# EAGLE design vfd (EAGLE 9.6.2)

## Sheet 1 of 2
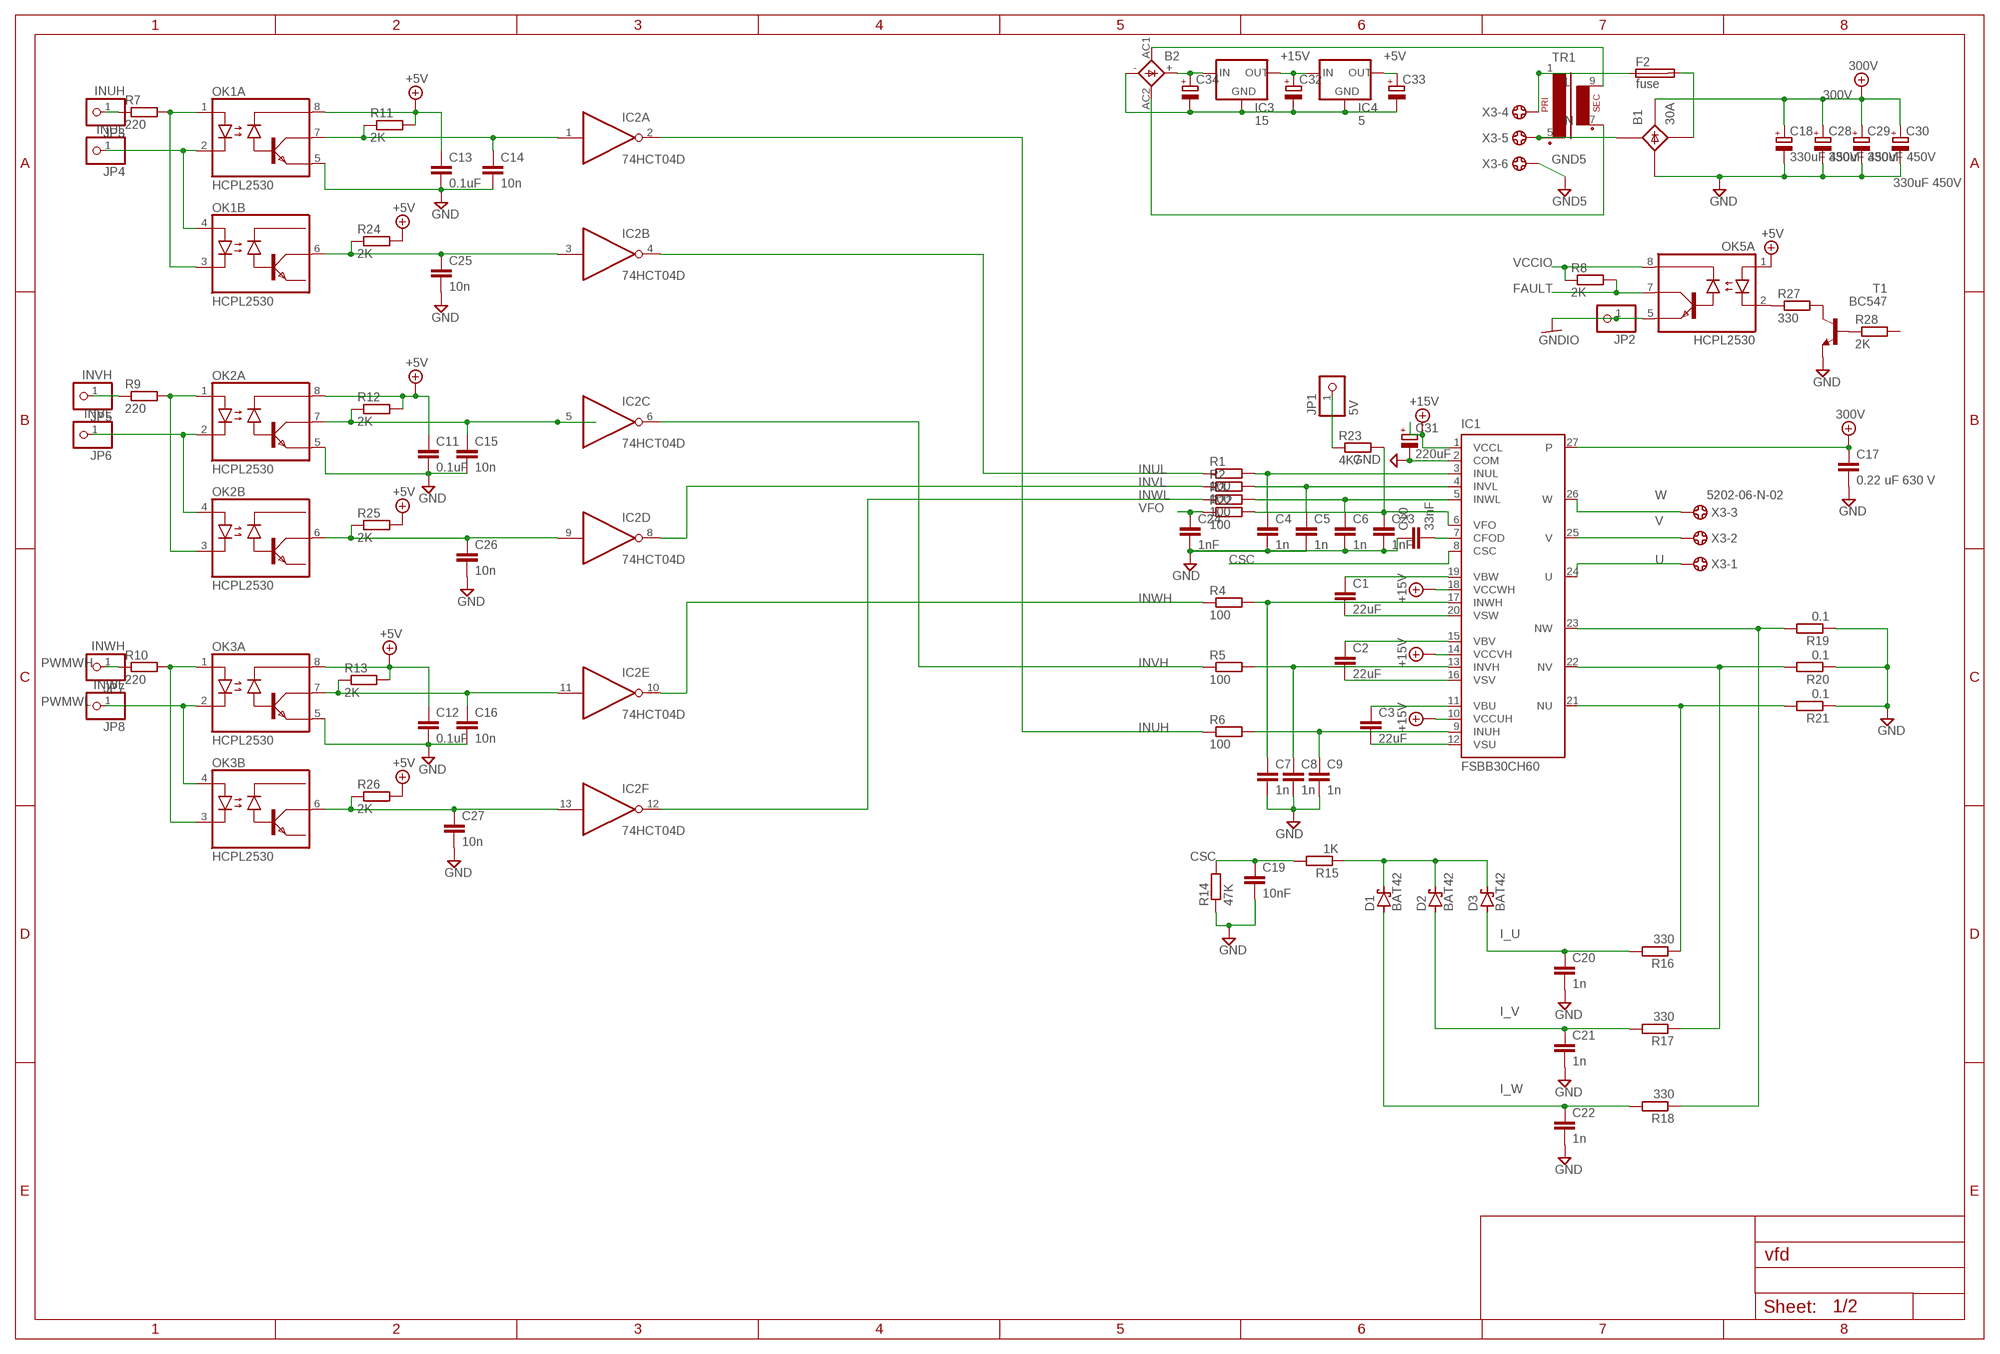
[diagram p0: schematic, sheet 1]

### Parts
B1  30A  B25A-  [B25A-]
B2  S41  [S41]
C1  22uF  C-EU025-024X044  [C025-024X044]
C2  22uF  C-EU025-024X044  [C025-024X044]
C3  22uF  C-EU025-024X044  [C025-024X044]
C4  1n  C-EU025-024X044  [C025-024X044]
C5  1n  C-EU025-024X044  [C025-024X044]
C6  1n  C-EU025-024X044  [C025-024X044]
C7  1n  C-EU025-024X044  [C025-024X044]
C8  1n  C-EU025-024X044  [C025-024X044]
C9  1n  C-EU025-024X044  [C025-024X044]
C10  33nF  C-EU025-024X044  [C025-024X044]
C11  0.1uF  C-EU050-025X075  [C050-025X075]
C12  0.1uF  C-EU050-025X075  [C050-025X075]
C13  0.1uF  C-EU050-025X075  [C050-025X075]
C14  10n  C-EU025-024X044  [C025-024X044]
C15  10n  C-EU025-024X044  [C025-024X044]
C16  10n  C-EU025-024X044  [C025-024X044]
C17  0.22 uF 630 V  C-EU150-091X182  [C150-091X182]
C18  330uF 450V  CPOL-EUE10-35  [EB35D]
C19  10nF  C-EU025-024X044  [C025-024X044]
C20  1n  C-EU025-024X044  [C025-024X044]
C21  1n  C-EU025-024X044  [C025-024X044]
C22  1n  C-EU025-024X044  [C025-024X044]
C23  1nF  C-EU025-024X044  [C025-024X044]
C24  1nF  C-EU025-024X044  [C025-024X044]
C25  10n  C-EU025-024X044  [C025-024X044]
C26  10n  C-EU025-024X044  [C025-024X044]
C27  10n  C-EU025-024X044  [C025-024X044]
C28  330uF 450V  CPOL-EUE10-35  [EB35D]
C29  330uF 450V  CPOL-EUE10-35  [EB35D]
C30  330uF 450V  CPOL-EUE10-35  [EB35D]
C31  220uF  CPOL-EUB45181B  [B45181B]
C32  CPOL-EUB45181A  [B45181A]
C33  CPOL-EUB45181A  [B45181A]
C34  CPOL-EUB45181A  [B45181A]
D1  BAT42  [DO35-10]
D2  BAT42  [DO35-10]
D3  BAT42  [DO35-10]
F2  fuse  SH22  [SH22]
IC1  FSBB30CH60  [FSBB30CH60]
IC2  74HCT04D  [SO14]
IC3  15  78MXXL  [78MXXL]
IC4  5  78MXXL  [78MXXL]
JP1  5V  PINHD-1X1  [1X01]
JP2  PINHD-1X1  [1X01]
JP3  INUH  PINHD-1X1  [1X01]
JP4  INUL  PINHD-1X1  [1X01]
JP5  INVH  PINHD-1X1  [1X01]
JP6  INVL  PINHD-1X1  [1X01]
JP7  INWH  PINHD-1X1  [1X01]
JP8  INWL  PINHD-1X1  [1X01]
OK1  HCPL2530  [DIL08]
OK2  HCPL2530  [DIL08]
OK3  HCPL2530  [DIL08]
OK5  HCPL2530  [DIL08]
R1  100  R-EU_0204/7  [0204/7]
R2  100  R-EU_0204/7  [0204/7]
R3  100  R-EU_0204/7  [0204/7]
R4  100  R-EU_0204/7  [0204/7]
R5  100  R-EU_0204/7  [0204/7]
R6  100  R-EU_0204/7  [0204/7]
R7  220  R-EU_0204/7  [0204/7]
R8  2K  R-EU_0204/7  [0204/7]
R9  220  R-EU_0204/7  [0204/7]
R10  220  R-EU_0204/7  [0204/7]
R11  2K  R-EU_0204/7  [0204/7]
R12  2K  R-EU_0204/7  [0204/7]
R13  2K  R-EU_0204/7  [0204/7]
R14  47K  R-EU_0204/7  [0204/7]
R15  1K  R-EU_0204/7  [0204/7]
R16  330  R-EU_0204/7  [0204/7]
R17  330  R-EU_0204/7  [0204/7]
R18  330  R-EU_0204/7  [0204/7]
R19  0.1  R-EU_0204/7  [0204/7]
R20  0.1  R-EU_0204/7  [0204/7]
R21  0.1  R-EU_0204/7  [0204/7]
R22  100  R-EU_0204/7  [0204/7]
R23  4K7  R-EU_0204/7  [0204/7]
R24  2K  R-EU_0204/7  [0204/7]
R25  2K  R-EU_0204/7  [0204/7]
R26  2K  R-EU_0204/7  [0204/7]
R27  330  R-EU_0204/7  [0204/7]
R28  2K  R-EU_0204/7  [0204/7]
T1  BC547  [TO92]
TR1  EI30-1  [EI30-1]
X3  5202-06-N-02  [5202-06-N-02]

### Nets
3: C4.1 IC1.3(INUL) R1.2
4: C5.1 IC1.4(INVL) R2.2
5: C6.1 IC1.5(INWL) R3.2
6: C23.1 IC1.6(VFO) R22.2 R23.2
7: C10.2 IC1.7(CFOD)
9: C9.1 IC1.9(INUH) R6.2
11: C3.1 IC1.11(VBU)
13: C8.1 IC1.13(INVH) R5.2
15: C2.1 IC1.15(VBV)
16: C2.2 IC1.16(VSV)
17: C7.1 IC1.17(INWH) R4.2
19: C1.1 IC1.19(VBW)
20: C1.2 IC1.20(VSW)
300V: B1.+1(+) C17.1 C18.+ C28.+ C29.+ C30.+ IC1.27(P)
+5V: C11.1 C12.1 C13.1 C33.+ IC4.OUT OK1.8(A:VCC) OK2.8(A:VCC) OK3.8(A:VCC) OK5.1(A:A1) R11.2 R12.2 R13.2 R24.2 R25.2 R26.2
+15V: C31.+ C32.+ IC1.1(VCCL) IC1.10(VCCUH) IC1.14(VCCVH) IC1.18(VCCWH) IC3.OUT IC4.IN
CSC: C19.1 IC1.8(CSC) R14.2 R15.2
FAULT: OK5.7(A:VO1) R8.2
GND: B1.-1(-) C4.2 C5.2 C6.2 C7.2 C8.2 C9.2 C10.1 C11.2 C12.2 C13.2 C14.2 C15.2 C16.2 C17.2 C18.- C19.2 C20.2 C21.2 C22.2 C23.2 C24.2 C25.2 C26.2 C27.2 C28.- C29.- C30.- C31.- IC1.2(COM) OK1.5(A:GND) OK2.5(A:GND) OK3.5(A:GND) R14.1 R19.1 R20.1 R21.1 T1.1(E)
GND5: X3.6
GNDIO: JP2.1 OK5.5(A:GND)
I_U: C20.1 D3.A R16.2
I_V: C21.1 D2.A R17.2
I_W: C22.1 D1.A R18.2
INUH: IC2.2(A:O) R6.1
INUL: IC2.4(B:O) R1.1
INVH: IC2.6(C:O) R5.1
INVL: IC2.8(D:O) R2.1
INWH: IC2.10(E:O) R4.1
INWL: IC2.12(F:O) R3.1
L: F2.1 TR1.1 X3.4
N: B1.AC1-(AC1) TR1.5(P2) X3.5
N$1: B2.AC1 TR1.9(S4)
N$2: JP1.1 R23.1
N$3: B2.AC2 TR1.7(S3)
N$4: OK5.2(A:C1) R27.1
N$5: R28.1 T1.2(B)
N$6: B1.AC2-(AC2) F2.2
N$7: B2.+ C34.+ IC3.IN
N$9: R27.2 T1.3(C)
N$11: B2.- C32.- C33.- C34.- IC3.GND IC4.GND
N$14: JP3.1 R7.1
N$19: JP5.1 R9.1
N$20: C14.1 IC2.1(A:I) OK1.7(A:VO1) R11.1
N$21: OK1.1(A:A1) OK1.3(B:C2) R7.2
N$22: JP4.1 OK1.2(A:C1) OK1.4(B:A2)
N$27: C15.1 IC2.5(C:I) OK2.7(A:VO1) R12.1
N$29: C25.1 IC2.3(B:I) OK1.6(B:VO2) R24.1
N$30: D1.C D2.C D3.C R15.1
N$31: IC1.21(NU) R16.1 R21.2
N$32: IC1.22(NV) R17.1 R20.2
N$33: IC1.23(NW) R18.1 R19.2
N$34: C27.1 IC2.13(F:I) OK3.6(B:VO2) R26.1
N$36: C16.1 IC2.11(E:I) OK3.7(A:VO1) R13.1
N$38: C26.1 IC2.9(D:I) OK2.6(B:VO2) R25.1
N$39: JP6.1 OK2.2(A:C1) OK2.4(B:A2)
N$40: OK2.1(A:A1) OK2.3(B:C2) R9.2
N$42: OK3.1(A:A1) OK3.3(B:C2) R10.2
PWMWH: JP7.1 R10.1
PWMWL: JP8.1 OK3.2(A:C1) OK3.4(B:A2)
U: IC1.24(U) X3.1
V: IC1.25(V) X3.2
VCCIO: OK5.8(A:VCC) R8.1
VFO: C24.1 R22.1
VSU: C3.2 IC1.12(VSU)
W: IC1.26(W) X3.3
Unconnected: B1.+ B1.- B1.AC1 B1.AC2 OK5.3(B:C2) OK5.4(B:A2) OK5.6(B:VO2) R28.2

## Sheet 2 of 2

## Power pins joined to a net without a drawn wire
+15V: IC2.14(P:VCC)
GND: IC2.7(P:GND)

## Library data of the parts
B1 = rectifier:B25A-: RECTIFIER 25-A bridge
B2 = rectifier:S41: SEMIKRON RECTIFIER
C1-C17 C19-C27 = rcl:C-EU: CAPACITOR, European symbol; SPICEPREFIX: C
C18 C28-C34 = rcl:CPOL-EU: POLARIZED CAPACITOR, European symbol; SPICEPREFIX: C
D1-D3 = diode:BAT42: DIODE barrier diode
F2 = fuse:SH22: FUSE HOLDER CS PFP30, Schukat; OC_FARNELL: unknown; OC_NEWARK: unknown
IC1 = FSBB30CH60:FSBB30CH60: Smart Power Module 600V-30A IGBT inverter for three-phase DC/AC power conversion Source: http://www.fairchildsemi.com/ds/FS/FSBB30CH60.pdf Check availability <https://pricing.snapeda.com/parts/FSBB30CH60/ON%20Semiconductor/view-part?ref=eda>; AVAILABILITY: In Stock; DESCRIPTION: Power Driver Module IGBT 3 Phase 600 V 30 A 27-PowerDIP Module (1.205, 30.60mm); MF: ON Semiconductor; MP: FSBB30CH60; PACKAGE: PowerDIP-27 Fairchild Semiconductor; PRICE: None; PURCHASE-URL: https://pricing.snapeda.com/search/part/FSBB30CH60/?ref=eda
IC2 = 74xx-eu:74*04: Hex INVERTER
IC3 IC4 = v-reg:78MXXL: VOLTAGE REGULATOR
JP1-JP8 = pinhead:PINHD-1X1: PIN HEADER
OK1-OK3 OK5 = optocoupler:HCPL2530: HEWLETT PACKARD OPTO COUPLER; MF: AGILENT TECHNOLOGIES; MPN: HCPL-2530-000E; OC_FARNELL: 9994793; OC_NEWARK: 31K6974
R1-R28 = rcl:R-EU_: RESISTOR, European symbol; SPICEPREFIX: R
T1 = transistor:BC547: NPN TRANSISTOR
TR1 = trafo:EI30-1: TRANSFORMER 1 primary winding, 1 secondary winding ERA
X3 = con-ebyelectro:5202-06-N-02: Barrier Blocks Sreies 5202 Source: http://www.ebyelectro.com/PDF/5202-XX-N-02.pdf; OC_FARNELL: unknown; OC_NEWARK: unknown

## Board
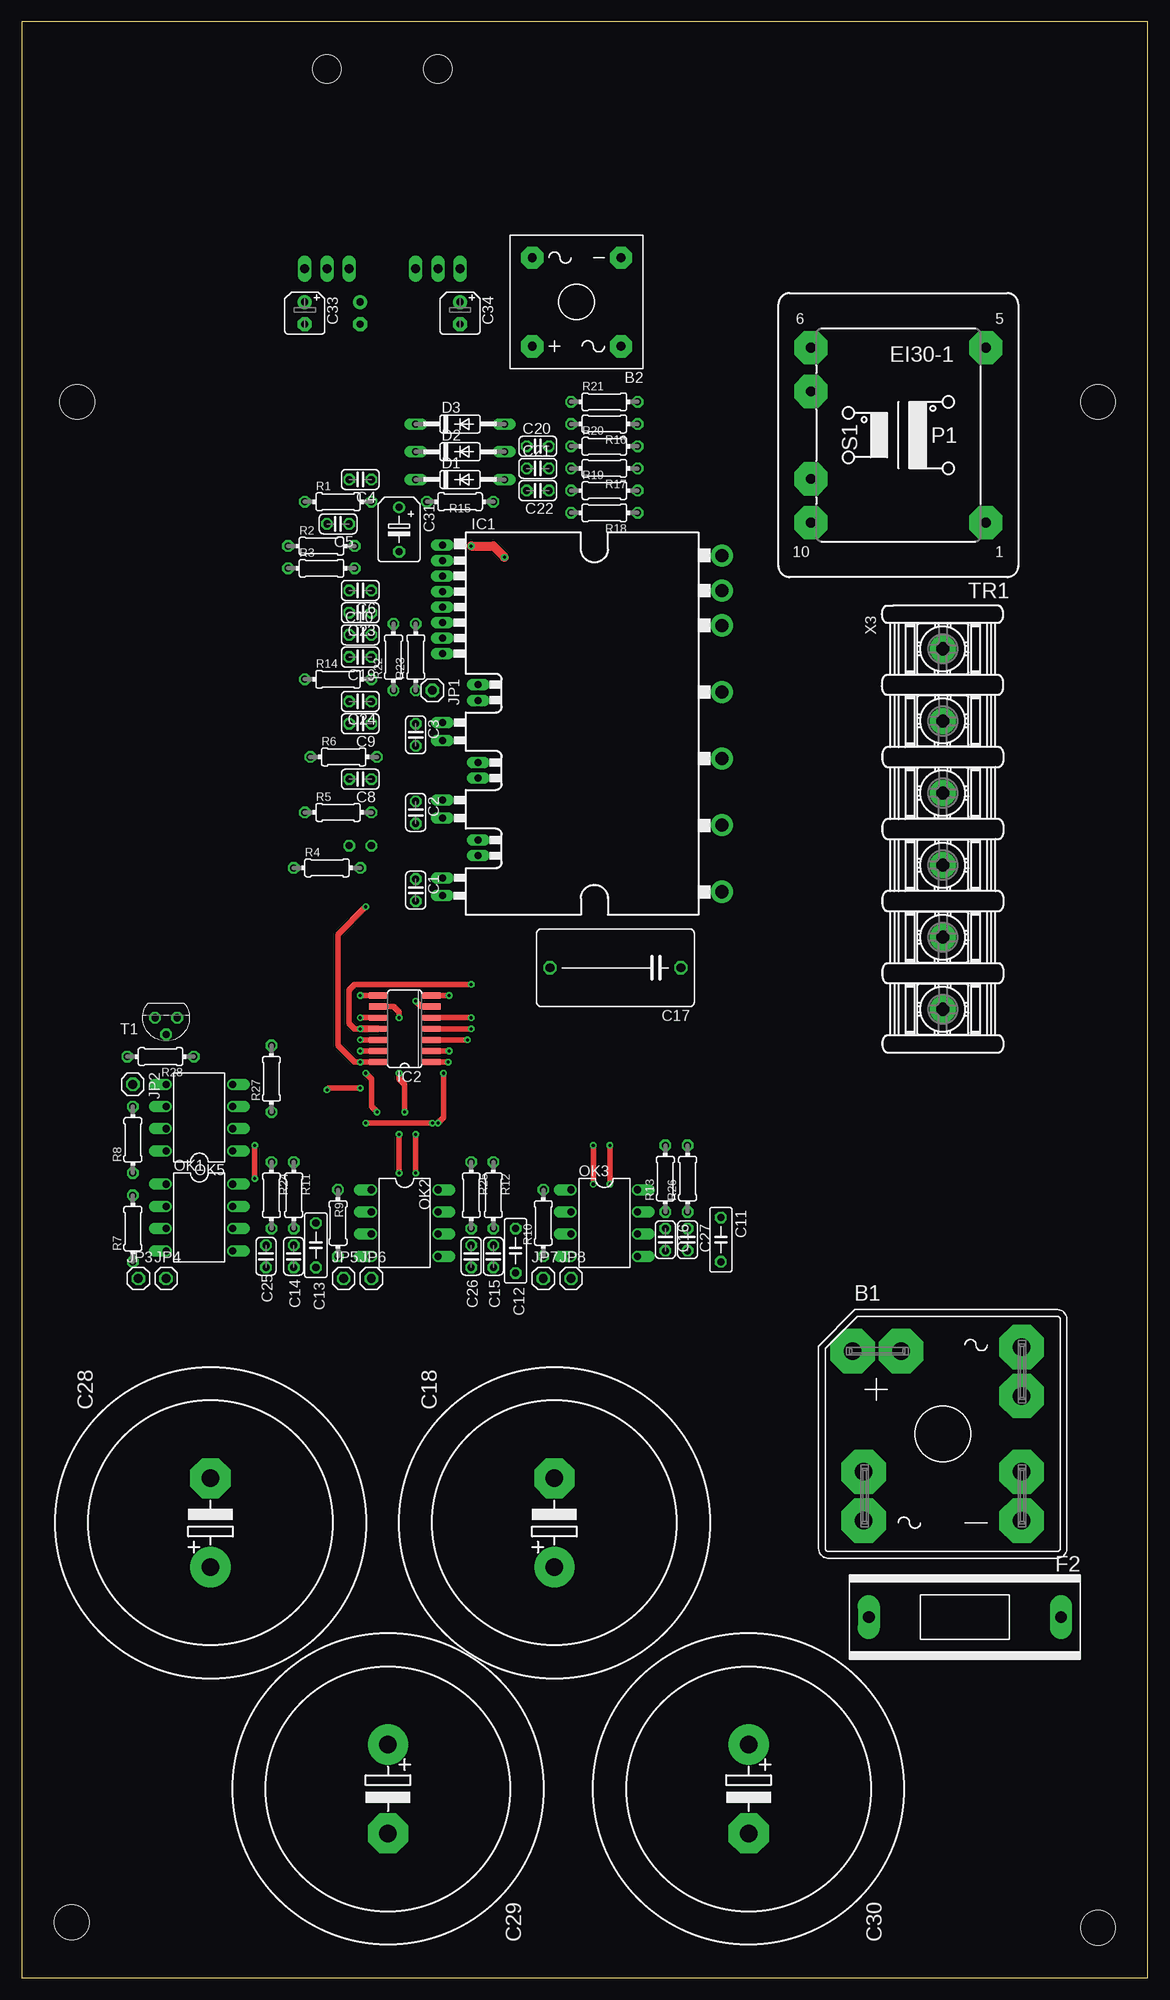
[diagram p1: board, top side]
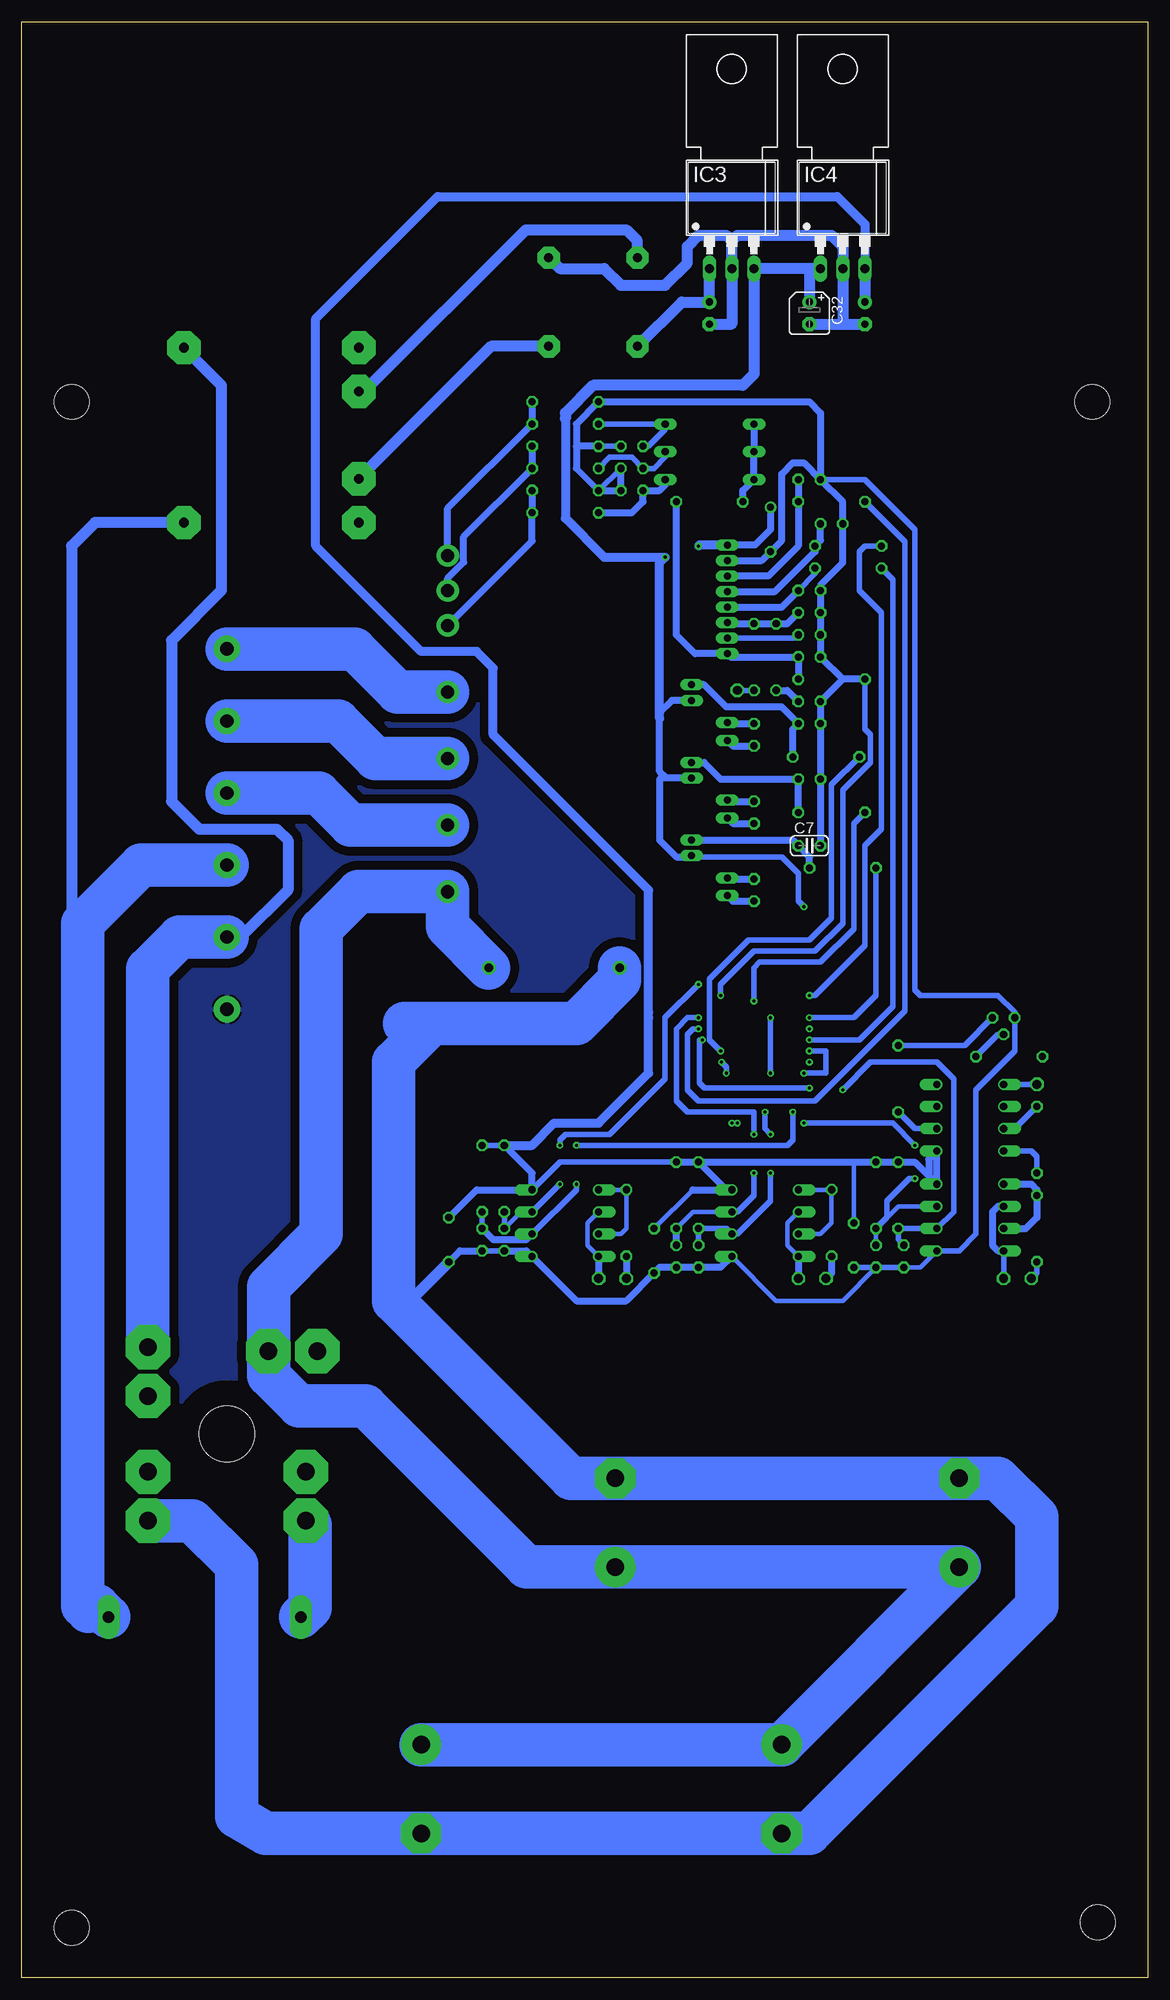
[diagram p2: board, bottom side, seen from below]

Size 128.88 x 223.82 mm. Coordinates in mm from the lower left corner, seen from the top.
Outline: 0,0 128.88,0 128.88,223.82 0,223.82 0,0
Copper layers (1*16): Top 0.035mm / dielectric 1.5mm / Bottom 0.035mm
Design rules "default": minimum track width 6mil, minimum drill 0.35mm, track to track 6mil, track to pad 6mil, pad to pad 6mil, via to via 6mil, smd to smd 6mil, copper to edge 40mil, drill to drill 6mil, minimum pad ring 10mil, minimum via ring 8mil, stop-mask expansion 4mil, vias tented up to drill 0mil, thermal gap 10mil
Holes 4 mm at 123.19,5.71 5.71,6.35 6.35,180.34 123.19,180.34

### Footprints (pad centres in the part's own frame; a part is rotated, then mirrored left to right if it is on the bottom)
B25A- = drill 2.007 pad 5.08 octagon: + -10.338,9.449; +1 -4.75,9.449; - 9.042,-4.343; -1 9.042,-9.931; AC1 9.042,4.343; AC1- 9.042,9.931; AC2 -9.042,-4.343; AC2- -9.042,-9.931 | hole 6.401: 0,0
S41 = drill 1.016 pad 2.54 octagon: + 5.08,5.08; - -5.08,-5.08; AC1 -5.08,5.08; AC2 5.08,-5.08
C025-024X044 = drill 0.813 octagon: 1 -1.27,0; 2 1.27,0
C050-025X075 = drill 0.813 octagon: 1 -2.54,0; 2 2.54,0
C150-091X182 = drill 1.016 octagon: 1 -7.493,0; 2 7.493,0
EB35D = drill 2.007 pad 4.597: + -5.08,0 | drill 2.007 pad 4.597 octagon: - 5.08,0
B45181B = drill 0.813: + -2.54,0 | drill 0.813 octagon: - 2.54,0
B45181A = drill 0.813 pad 1.6: + -1.27,0 | drill 0.813 pad 1.6 octagon: - 1.27,0
DO35-10 = drill 0.813 long: A 5.08,0; C -5.08,0
SH22 = drill 1.321 pad 2.54 long: 1 -10.998,0; 2 10.998,0
FSBB30CH60 = drill 0.8 pad 1.27 long: 1 -20.447,-16; 2 -18.669,-16; 3 -16.891,-16; 4 -15.113,-16; 5 -13.335,-16; 6 -11.557,-16; 7 -9.779,-16; 8 -8.001,-16; 9 -4.445,-11.9; 10 -2.667,-11.9; 11 -0.136,-16; 12 1.914,-16; 13 4.445,-11.9; 14 6.223,-11.9; 15 8.754,-16; 16 10.804,-16; 17 13.335,-11.9; 18 15.113,-11.9; 19 17.644,-16; 20 19.694,-16 | drill 1.5 pad 2.54: 21 -19.24,16; 22 -15.24,16; 23 -11.24,16; 24 -3.62,16; 25 4,16; 26 11.62,16; 27 19.24,16
SO14 = smd 0.66 x 2.032: 1 -3.81,-3.073; 2 -2.54,-3.073; 3 -1.27,-3.073; 4 0,-3.073; 5 1.27,-3.073; 6 2.54,-3.073; 7 3.81,-3.073; 8 3.81,3.073; 9 2.54,3.073; 10 1.27,3.073; 11 0,3.073; 12 -1.27,3.073; 13 -2.54,3.073; 14 -3.81,3.073
78MXXL = drill 1.016 long: GND 0,-5.08; IN -2.54,-5.08; OUT 2.54,-5.08 | hole 3.302: 0,17.78
1X01 = drill 1.016 octagon: 1 0,0
DIL08 = drill 0.813 offset: 1 -3.81,-3.81; 2 -1.27,-3.81; 3 1.27,-3.81; 4 3.81,-3.81; 5 3.81,3.81; 6 1.27,3.81; 7 -1.27,3.81; 8 -3.81,3.81
0204/7 = drill 0.813 octagon: 1 -3.81,0; 2 3.81,0
TO92 = drill 0.813 octagon: 1 1.27,0; 2 0,1.905; 3 -1.27,0
EI30-1 = drill 1.118 pad 3.81 octagon: 1 -10.008,10.008; 5 -10.008,-10.008; 6 10.008,-10.008; 7 10.008,-5.004; 9 10.008,5.004; 10 10.008,10.008
5202-06-N-02 = drill 1.5 pad 3: 1 -20.625,0; 2 -12.375,0; 3 -4.125,0; 4 4.125,0; 5 12.375,0; 6 20.625,0

### Placement (x,y rotation side)
B1  105.41,62.23 0 top
B2  63.5,191.77 180 top
C1  45.09,124.46 270 top
C2  45.09,133.35 270 top
C3  45.09,142.24 270 top
C4  38.73,171.45 180 top
C5  36.2,166.37 180 top
C6  38.73,158.75 180 top
C7  38.73,129.54 0 bottom
C8  38.73,137.16 180 top
C9  38.73,143.51 180 top
C10  38.73,153.67 0 top
C11  80.01,84.45 270 top
C12  56.52,83.19 270 top
C13  33.66,83.82 270 top
C14  31.11,82.55 270 top
C15  53.98,82.55 270 top
C16  73.66,84.45 270 top
C17  67.94,115.57 180 top
C18  60.96,52.07 90 top
C19  38.73,151.13 180 top
C20  59.05,175.26 0 top
C21  59.05,172.72 0 top
C22  59.05,170.18 0 top
C23  38.73,156.21 180 top
C24  38.73,146.05 180 top
C25  27.94,82.55 270 top
C26  51.44,82.55 270 top
C27  76.2,84.45 270 top
C28  21.59,52.07 90 top
C29  41.91,21.59 270 top
C30  83.19,21.59 270 top
C31  43.18,165.74 270 top
C32  38.73,190.5 270 bottom
C33  32.38,190.5 270 top
C34  50.16,190.5 270 top
D1  50.16,171.45 0 top
D2  50.16,174.62 0 top
D3  50.16,177.8 0 top
F2  107.95,41.27 180 top
IC1  64.14,143.51 270 top
IC2  43.81,108.58 90 top
IC3  47.62,200.66 0 bottom
IC4  34.92,200.66 0 bottom
JP1  46.99,147.32 270 top
JP2  12.7,102.23 270 top
JP3  13.34,80.01 0 top
JP4  16.51,80.01 0 top
JP5  36.83,80.01 0 top
JP6  40.01,80.01 0 top
JP7  59.69,80.01 0 top
JP8  62.87,80.01 0 top
OK1  20.32,87 270 top
OK2  43.81,86.36 270 top
OK3  66.67,86.36 270 top
OK5  20.32,98.42 90 top
R1  36.2,168.91 0 top
R2  34.29,163.83 0 top
R3  34.29,161.29 0 top
R4  34.92,127 0 top
R5  36.2,133.35 0 top
R6  36.83,139.7 0 top
R7  12.7,85.72 90 top
R8  12.7,95.89 90 top
R9  36.2,86.36 90 top
R10  59.69,86.36 90 top
R11  31.11,89.53 90 top
R12  53.98,89.53 90 top
R13  73.66,91.44 90 top
R14  36.2,148.59 0 top
R15  50.16,168.91 0 top
R16  66.67,177.8 180 top
R17  66.67,172.72 180 top
R18  66.67,167.64 180 top
R19  66.67,170.18 0 top
R20  66.67,175.26 0 top
R21  66.67,180.34 0 top
R22  42.55,151.13 90 top
R23  45.09,151.13 90 top
R24  28.57,89.53 90 top
R25  51.44,89.53 90 top
R26  76.2,91.44 90 top
R27  28.57,102.87 90 top
R28  15.88,105.41 180 top
T1  16.51,109.86 180 top
TR1  100.33,176.53 180 top
X3  105.41,131.44 270 top

### Tracks (layer width: path | path; a pad name or v marks a point on that pad's centre or on a via)
3
  Bottom 0.813: C4.1 R1.2 40.01,163.83 43.43,160.4 IC1.3
4
  Bottom 0.813: C5.1 37.47,164.47 R2.2 38.1,163.19 42.67,158.62 IC1.4
5
  Bottom 0.61: C6.1 38.1,160.66 R3.2
  Bottom 0.813: IC1.5 41.91,156.84 C6.1
6
  Bottom 0.61: R23.2 41.27,154.94
  Bottom 0.813: IC1.6 48.01,154.94 R22.2 41.27,154.94 C23.1
7
  Bottom 0.61: IC1.7 40.39,153.29 C10.2
9
  Bottom 0.813: R6.2 40.64,142.88 C9.1 41.91,145.41 48.26,145.41 50.8,147.96 IC1.9
11
  Bottom 0.813: IC1.11 48,143.51 C3.1
13
  Bottom 0.813: R5.2 C8.1 48.9,137.16 50.8,139.06 IC1.13
15
  Bottom 0.813: IC1.15 48,134.62 C2.1
16
  Bottom 0.813: IC1.16 47.51,132.08 C2.2
17
  Bottom 0.813: IC1.17 40.64,130.18 C7.1 38.73,128.27 R4.2
19
  Bottom 0.813: IC1.19 48,125.73 C1.1
20
  Bottom 0.813: IC1.20 47.51,123.19 C1.2
300V
  Bottom 5: C30.+ C29.+ C28.+ C18.+ 71.12,46.99 89.53,65.41 97.16,65.41 100.66,68.91 B1.+1 100.66,79.05 94.61,85.09 94.61,120.02 90.36,124.27 IC1.27 80.14,120.27 C17.1
+5V
  Bottom 0.508: 71.75,90.17 OK3.8 | C12.1 52.07,90.17 | 25.4,90.81 OK1.8 | 33.66,93.34 C13.1
  Bottom 0.61: R26.2 R13.2 | OK3.8 67.31,93.34 R12.2
  Bottom 0.813: 52.07,90.17 OK2.8 48.26,90.17 R25.2 R12.2 R11.2 | 25.08,91.76 26.67,93.34 R24.2 R11.2 | 25.08,91.76 OK1.8 OK5.1 25.08,93.66 25.08,91.76 | 33.66,93.34 R11.2 | C11.1 76.83,90.17 OK3.8 70.48,92.08 R13.2
  Bottom 1.016: R13.2 70.48,95.25 67.94,97.79 62.87,97.79 57.15,103.5 57.15,109.86 57.15,110.49 57.15,124.46 74.93,142.24 74.93,149.86 76.83,151.76 83.19,151.76 95.25,163.83 95.25,189.87 81.28,203.84 35.56,203.84 32.38,200.66 IC4.OUT
  Bottom 1.27: IC4.OUT C33.+
+15V  (via drill 0.35)
  Top 0.61: v39.37,122.56 36.2,119.38 36.2,106.68 38.1,104.78 v38.73,104.78 IC2.14
  Top 1.016: v51.44,163.83 53.98,163.83 v55.24,162.56
  Bottom 0.61: v39.37,122.56 40.01,123.19 40.01,126.36 41.91,128.27 52.36,128.27
  Bottom 0.813: IC1.10 54.48,146.18 55.88,144.78 | IC1.14 55.12,137.29 | 55.12,137.29 55.75,137.29 55.88,137.16 55.88,130.18 53.98,128.27 52.36,128.27 IC1.18 | 55.12,137.29 55.88,138.05 55.88,144.15 | C31.+ 43.18,165.74 44.96,163.96 IC1.1
  Bottom 1.016: IC1.1 51.31,163.96 v51.44,163.83 | 55.88,144.15 55.88,144.78 55.88,161.93 v55.24,162.56 62.23,162.56 66.67,167 66.67,178.44
  Bottom 1.27: IC3.OUT 38.73,195.58 C32.+ | IC4.IN IC3.OUT | 66.67,178.44 66.67,179.07 63.5,182.25 46.35,182.25 45.09,183.51 IC3.OUT
CSC
  Bottom 0.813: R14.2 C19.1 47.75,151.13 IC1.8 51.82,151.51 53.98,153.67 R15.2
FAULT
  Bottom 0.61: OK5.7 15.24,97.16 R8.2
GND  (via drill 0.35)
  Top 0.61: v48.9,112.39 IC2.7
  Bottom 0.152: C31.- 44.2,162.18
  Bottom 0.508: OK2.5 42.55,77.47 34.92,77.47 C14.2 C13.2 26.04,81.28 OK1.5
  Bottom 0.61: C27.2 C16.2 | C25.2 C13.2 | C4.2 32.38,171.45 26.67,165.74 26.67,113.03 26.04,112.39 17.14,112.39 15.24,110.49 T1.1 15.24,106.05 19.68,101.6 19.68,85.09 21.59,83.19 OK1.5 | R14.1 32.38,142.88 31.75,142.24 31.75,139.06 34.92,135.89 34.92,120.65 38.1,117.47 45.09,117.47 48.9,113.67 v48.9,112.39 | R20.1 C20.2 | 65.41,172.72 R19.1 C21.2
  Bottom 0.813: C4.2 34.92,168.91 C5.2 34.92,161.93 37.47,159.38 C6.2 C23.2 C10.1 C19.2 34.92,148.59 | R14.1 34.92,148.59 | 34.92,148.59 C24.2 C9.2 C8.2 C7.2 | IC1.2 44.2,162.18 41.91,164.47 41.91,172.09 40.64,173.35 39.37,173.35 C4.2 | 65.41,175.26 65.41,177.8 R21.1 38.73,180.34 37.47,179.07 C4.2 | 65.41,175.26 65.41,172.72 | OK2.5 48.9,81.28 C26.2 C15.2 55.88,81.28 C12.2 59.69,77.47 65.41,77.47 OK3.5 71.12,83.19 C16.2 | C11.2 78.74,83.19 C27.2 | C18.- 60.96,58.42 | R19.1 C22.2 C21.2 | R20.1 65.41,175.26
  Bottom 1.27: 86.36,77.47 84.45,77.47 C11.2
  Bottom 5: 85.09,109.22 81.92,109.22 | 81.92,109.22 65.41,109.22 60.45,114.17 C17.2 | B1.-1 109.37,52.3 104.29,47.22 104.29,18.45 100.97,16.51 C30.- C29.- 38.73,16.51 12.7,42.55 12.7,52.7 17.14,57.15 C28.- C18.- 66.04,57.15 86.36,77.47 86.36,104.78 81.92,109.22
GND5
  pour Bottom (isolate 1.016): 0,223.52 128.91,223.52 128.91,2.54 125.73,-0.64 3.81,-0.64 0,3.17
  pour Bottom (isolate 1.016): 101.6,109.22 101.6,109.86 103.5,109.86 103.5,107.95 101.6,107.95
GNDIO
  Bottom 0.61: JP2.1 OK5.5
I_U
  Bottom 0.61: R16.2 D3.A 55.24,177.16 57.15,175.26 C20.1
I_V
  Bottom 0.61: R17.2 61.59,173.99 59.05,173.99 C21.1 56.52,172.72 55.24,173.99 D2.A
I_W
  Bottom 0.813: R18.2 59.05,167.64 57.78,168.91 C22.1 55.88,170.18 55.24,170.81 D1.A
INUH  (via drill 0.35)
  Top 0.61: v48.9,106.05 IC2.2
  Bottom 0.61: R6.1 36.2,136.53 36.2,121.28 38.73,118.75 45.72,118.75 50.16,114.3 50.16,107.31 v48.9,106.05
INUL  (via drill 0.35)
  Top 0.61: v51.44,108.58 IC2.4
  Bottom 0.61: R1.1 27.81,164.34 27.81,110.62 38.1,100.33 51.44,100.33 52.7,101.6 52.7,107.95 52.07,108.58 v51.44,108.58
INVH  (via drill 0.35)
  Top 0.61: v45.09,111.76 45.72,111.12 IC2.6
  Bottom 0.61: R5.1 33.66,132.08 33.66,120.02 37.47,116.2 44.45,116.2 45.09,115.57 v45.09,111.76
INVL  (via drill 0.35)
  Top 0.61: v38.73,112.39 IC2.8
  Bottom 0.61: R2.1 32.38,163.83 33.02,163.19 33.02,158.75 30.48,156.21 30.48,131.44 32.38,129.54 32.38,118.11 38.1,112.39 v38.73,112.39
INWH  (via drill 0.35)
  Top 0.61: 40.01,109.86 IC2.10 v38.73,109.86
  Bottom 0.61: R4.1 31.11,112.39 33.66,109.86 v38.73,109.86
INWL  (via drill 0.35)
  Top 0.61: v38.73,107.31 IC2.12
  Bottom 0.61: R3.1 29.21,160.02 29.21,111.12 33.02,107.31 v38.73,107.31
L
  Bottom 1.27: 121.92,120.64 123.19,121.92 123.19,163.83 120.5,166.52 TR1.1
  Bottom 5: 121.92,42.55 121.92,120.64 115.25,127.32 X3.4 | 121.92,42.55 121.28,41.91 | F2.1 120.22,42.55 121.92,42.55
N
  Bottom 1.27: TR1.5 106.05,182.25 106.05,158.75 111.76,153.03 111.76,134.62 108.58,131.44 99.69,131.44 98.42,130.18 98.42,124.46 103.81,119.07 X3.5
  Bottom 5: X3.5 110.8,119.07 114.45,115.42 B1.AC1-
N$1
  Bottom 1.27: B2.AC1 75.16,186.69 TR1.9
N$2
  Bottom 0.61: JP1.1 R23.1
N$3
  Bottom 1.27: B2.AC2 58.42,198.75 59.69,200.03 71.2,200.03 89.69,181.53 TR1.7
N$4
  Bottom 0.61: OK5.2 26.67,97.16 R27.1
N$5
  Bottom 0.61: R28.1 17.14,107.95 T1.2
N$6
  Bottom 5: 96.14,52.07 B1.AC2- 95.89,51.82 95.89,42.34 F2.2
N$7
  Bottom 1.27: IC3.IN C34.+ 53.34,191.77 B2.+
N$9
  Bottom 0.61: R27.2 20.95,106.68 T1.3
N$11
  Bottom 1.27: C34.- 47.62,189.23 IC3.GND 47.62,198.75 | C32.- 34.92,189.23 | 34.92,189.23 C33.- | 34.92,189.23 IC4.GND 34.92,198.12 36.2,199.39 46.99,199.39 47.62,198.75 | B2.- 67.31,195.58 62.23,195.58 60.33,193.68 55.24,193.68 52.7,196.22 52.7,198.12 51.44,199.39 48.26,199.39 47.62,198.75
N$14
  Bottom 0.61: R7.1 12.7,80.64 JP3.1
N$19
  Bottom 0.813: R9.1 36.2,80.64 JP5.1
N$20  (via drill 0.35)
  Top 0.61: v47.62,97.79 48.26,98.42 v48.26,103.5 | v46.99,97.79 v39.37,97.79 | v26.67,91.44 v26.67,95.25 | v48.79,104.78 IC2.1
  Bottom 0.508: OK1.7 28.57,88.27 R11.1 C14.1
  Bottom 0.61: v48.79,104.78 48.26,104.24 v48.26,103.5 | v47.62,97.79 v46.99,97.79 | v26.67,95.25 29.21,97.79 v39.37,97.79 | R11.1 29.84,87 29.84,88.9 27.3,91.44 v26.67,91.44
N$21
  Bottom 0.813: OK1.3 13.97,85.72 12.7,87 R7.2 12.7,90.17 13.34,90.81 OK1.1
N$22
  Bottom 0.61: OK1.4 JP4.1
  Bottom 0.813: OK1.2 17.14,88.27 17.78,87.63 17.78,83.82 17.14,83.19 OK1.4
N$27  (via drill 0.35)
  Top 0.61: v45.09,92.08 v45.09,96.52 | v51.44,109.86 IC2.5 46.35,109.86
  Bottom 0.508: R12.1 52.07,87.63 48.26,87.63 OK2.7
  Bottom 0.61: v45.09,92.08 45.09,89.53 46.99,87.63 48.26,87.63 | v45.09,96.52 45.09,99.06 52.7,99.06 53.98,100.33 53.98,108.58 52.7,109.86 v51.44,109.86
  Bottom 0.813: C15.1 R12.1
N$29  (via drill 0.35)
  Top 0.61: v38.73,101.8 35.12,101.8 v34.92,101.6 | IC2.3 v51,107.31
  Bottom 0.61: C25.1 28.57,84.45 R24.1 OK1.6 22.23,87.63 22.23,102.87 24.13,104.78 31.75,104.78 v34.92,101.6 | v51,107.31 51.31,107.31 51.31,102.36 50.75,101.8 v38.73,101.8
N$30
  Bottom 0.813: D3.C D2.C D1.C 46.35,170.18 R15.1
N$31
  Bottom 0.813: R21.2 R16.1 80.14,168.15 IC1.21
N$32
  Bottom 0.813: R20.2 R17.1 78.31,164.9 78.31,161.99 80.14,160.16 IC1.22
N$33
  Bottom 0.813: R19.2 R18.1 70.48,164.4 IC1.23
N$34  (via drill 0.35)
  Top 0.61: v65.41,90.81 v65.41,95.25 | v40.64,99.06 40.01,99.69 40.01,102.87 v39.37,103.5 | v38.73,106.05 IC2.13
  Bottom 0.61: R26.1 C27.1 | OK3.6 65.41,90.17 v65.41,90.81 | v40.64,99.06 40.64,95.89 41.27,95.25 v65.41,95.25 | v39.37,103.5 36.83,103.5 36.83,106.05 v38.73,106.05
  Bottom 0.813: C27.1 74.93,84.45 71.12,84.45 OK3.6
N$36  (via drill 0.35)
  Top 0.61: v67.31,90.81 v67.31,95.25 | v51.44,113.67 38.1,113.67 37.47,113.03 37.47,109.22 38.1,108.58 v38.73,108.58
  Top 0.813: IC2.11 v38.73,108.58
  Bottom 0.508: OK3.7 71.75,87.63 C16.1
  Bottom 0.61: R13.1 C16.1 | v67.31,90.81 OK3.7 | v67.31,95.25 67.31,95.89 66.67,96.52 61.59,96.52 55.24,102.87 55.24,109.86 v51.44,113.67
N$38  (via drill 0.35)
  Top 0.61: v43.18,92.08 v43.18,96.52 | v43.18,103.5 43.18,102.87 43.81,102.23 v43.81,99.06 | v43.18,109.86 43.18,110.49 42.55,111.12 IC2.9
  Bottom 0.61: C26.1 R25.1 48.26,85.72 OK2.6 46.99,85.09 43.18,88.9 v43.18,92.08 | v43.18,96.52 43.81,97.16 v43.81,99.06 | v43.18,103.5 v43.18,109.86
N$39
  Bottom 0.508: OK2.2 41.27,86.36 41.27,83.82 OK2.4
  Bottom 0.813: OK2.4 JP6.1
N$40
  Bottom 0.508: OK2.3 37.47,85.09 36.2,86.36 R9.2 OK2.1
N$42
  Bottom 0.508: OK3.3 60.33,85.09 59.69,85.72 R10.2 OK3.1
PWMWH
  Bottom 0.813: R10.1 JP7.1
PWMWL
  Bottom 0.508: OK3.4 64.14,83.82 64.14,86.36 OK3.2
  Bottom 0.813: OK3.4 JP8.1
U
  Bottom 5: IC1.24 85.85,147.13 90.79,152.07 X3.1
V
  Bottom 5: IC1.25 88.39,139.51 92.7,143.82 X3.2
VCCIO
  Bottom 0.61: OK5.8 13.34,94.61 12.7,93.98 R8.1
VFO
  Bottom 0.813: R22.1 41.27,147.32 C24.1
VSU
  Bottom 0.813: IC1.12 47.51,140.97 C3.2
W
  Bottom 5: X3.3 94.93,135.57 91.25,131.89 IC1.26